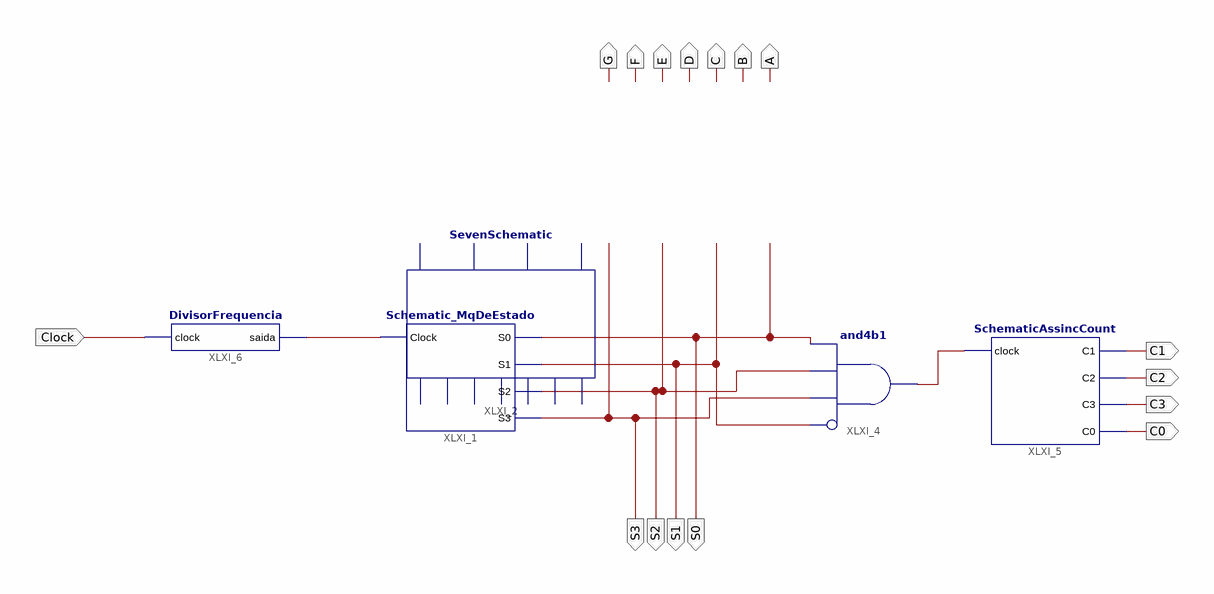
[diagram p0: schematic sheet 1]
// Xilinx ISE schematic TrabSchematic.sch (spartan3) as structural Verilog: 5 symbols, 16 ports
module TrabSchematic (
  input  Clock,
  output S0,
  output S1,
  output S2,
  output S3,
  output A,
  output B,
  output C,
  output D,
  output E,
  output F,
  output G,
  output C0,
  output C3,
  output C2,
  output C1
);

  wire XLXN_9, XLXN_11;

  SevenSchematic XLXI_2 (.E0(S0), .E1(S1), .E2(S2), .E3(S3), .A(A), .B(B), .C(C), .D(D), .E(E), .F(F), .G(G));
  Schematic_MqDeEstado XLXI_1 (.Clock(XLXN_11), .S1(S1), .S3(S3), .S2(S2), .S0(S0));
  and XLXI_4 (XLXN_9, ~S1, S3, S2, S0);  // and4b1
  SchematicAssincCount XLXI_5 (.clock(XLXN_9), .C1(C1), .C2(C2), .C3(C3), .C0(C0));
  DivisorFrequencia XLXI_6 (.clock(Clock), .saida(XLXN_11));
endmodule
